# Altium schematic sheet Main.SchDoc
size A3; SheetNumber: 2; SheetTotal: 22
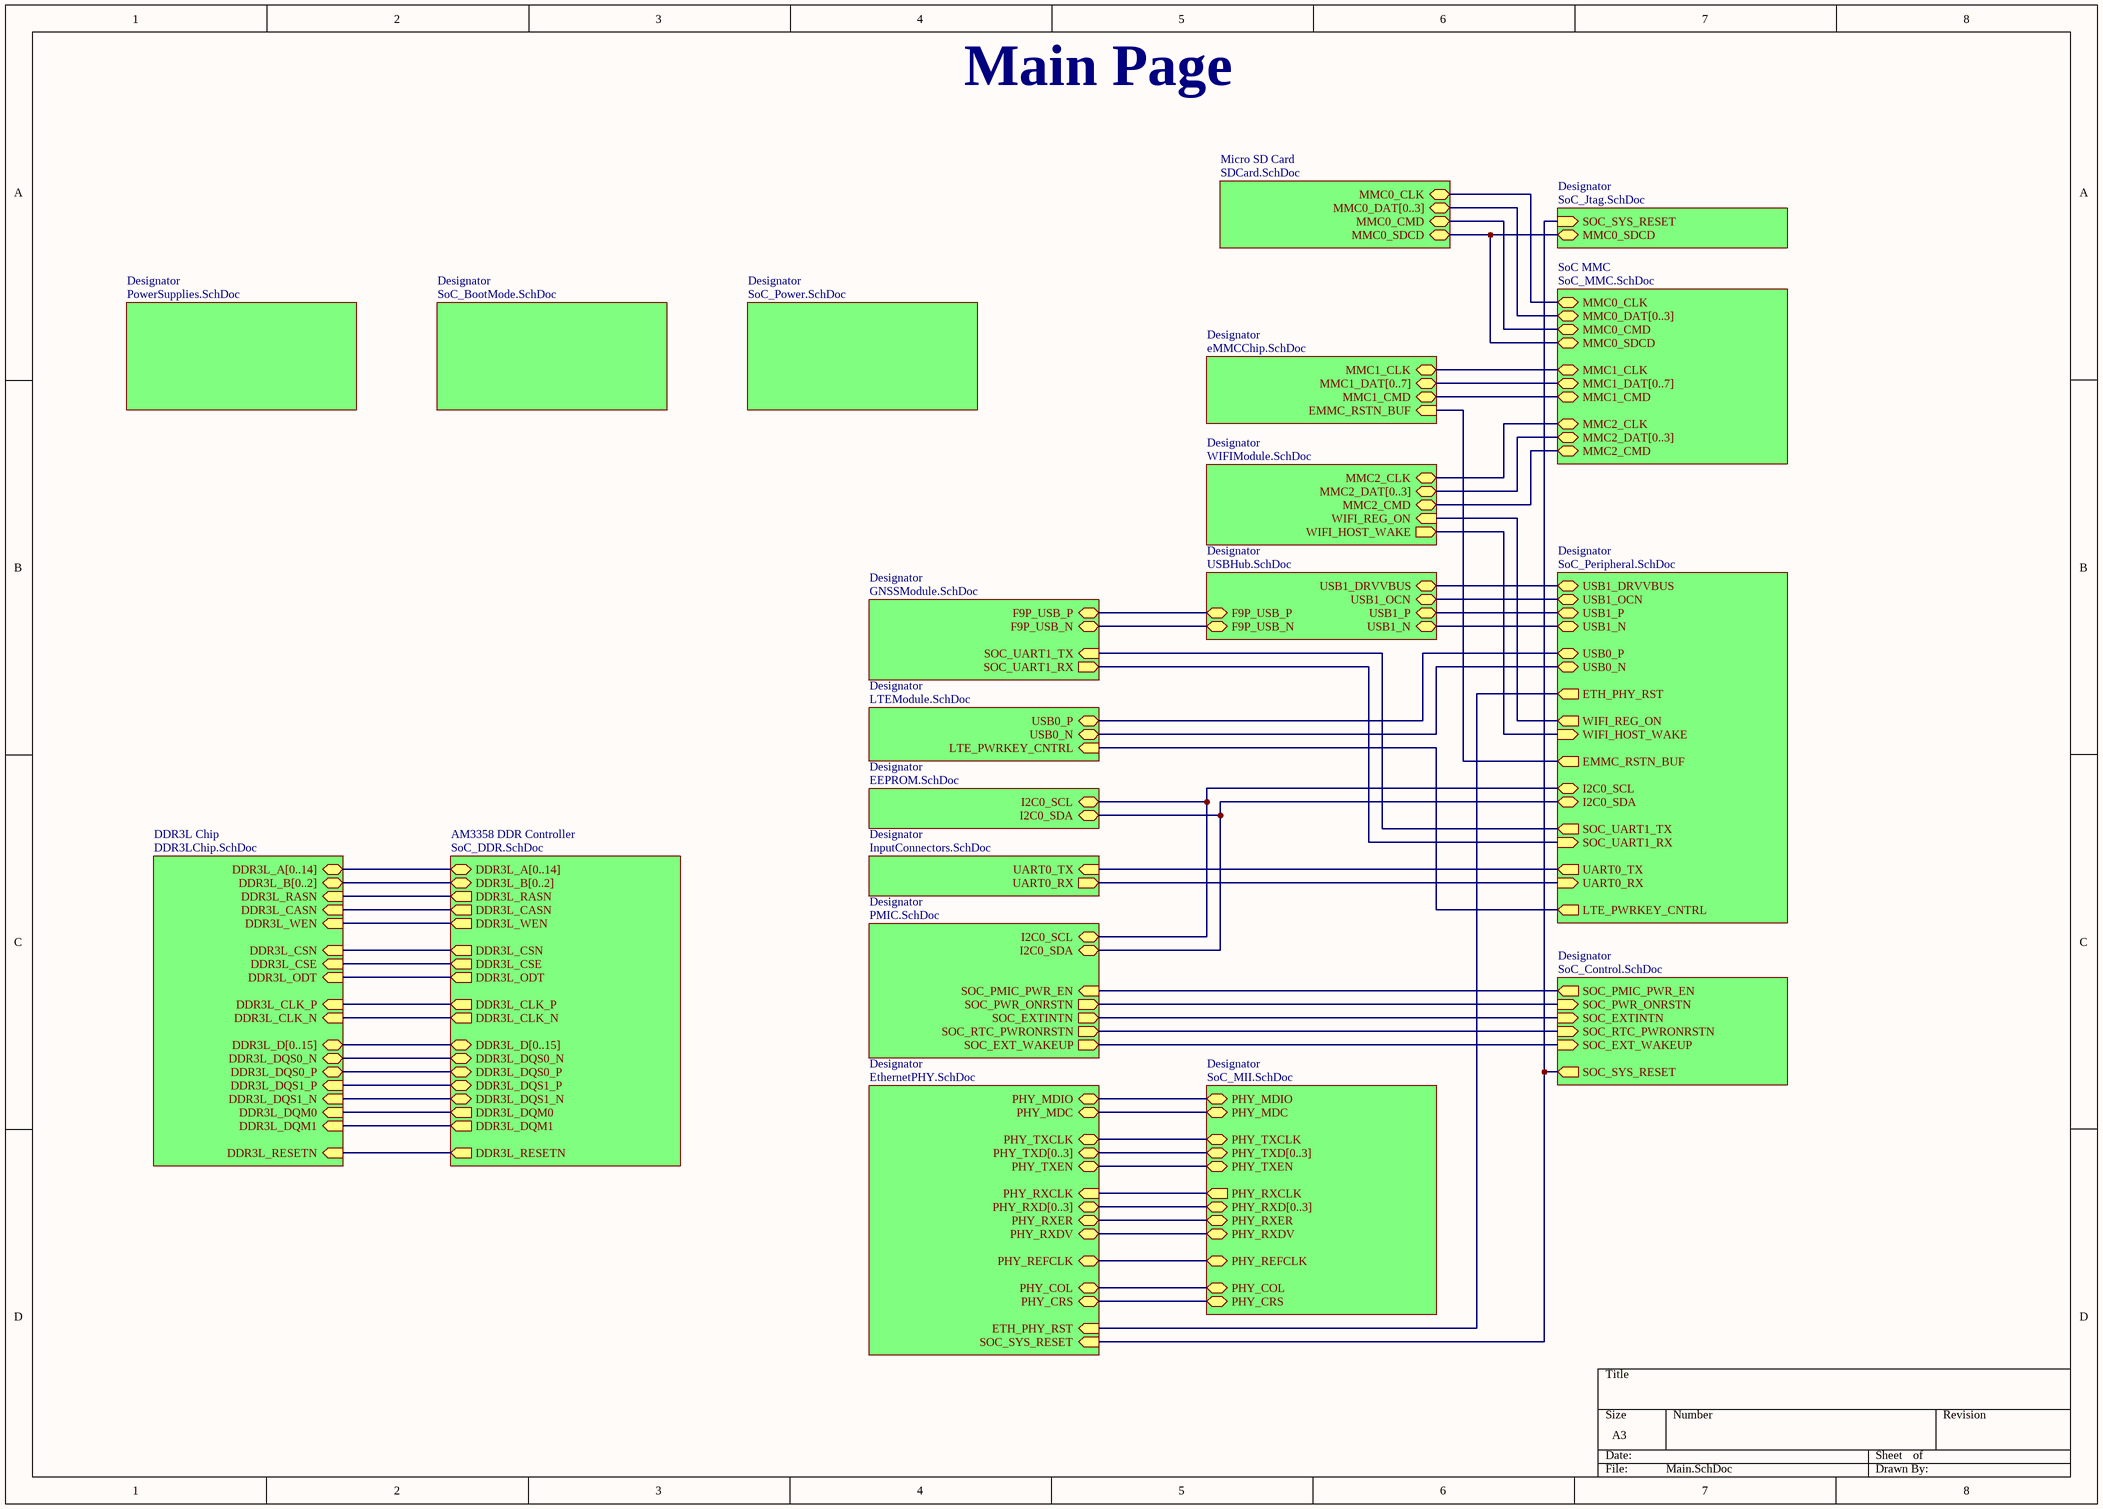
[diagram p0: Main.SchDoc]

## Sub-sheets
AM3358 DDR Controller = SoC_DDR.SchDoc: DDR3L_RASN (out), DDR3L_CASN (out), DDR3L_WEN (out), DDR3L_CSN (out), DDR3L_CSE (out), DDR3L_DQM0 (out), DDR3L_DQM1 (out), DDR3L_DQS0_N (bidir), DDR3L_DQS0_P (bidir), DDR3L_DQS1_N (bidir), DDR3L_RESETN (out), DDR3L_ODT (out), DDR3L_DQS1_P (bidir), DDR3L_A[0..14] (bidir), DDR3L_B[0..2] (bidir), DDR3L_D[0..15] (bidir), DDR3L_CLK_P (out), DDR3L_CLK_N (out)
DDR3L Chip = DDR3LChip.SchDoc: DDR3L_RASN (in), DDR3L_CASN (in), DDR3L_WEN (in), DDR3L_CSN (in), DDR3L_CSE (in), DDR3L_ODT (in), DDR3L_CLK_P (in), DDR3L_CLK_N (in), DDR3L_RESETN (in), DDR3L_DQM0 (in), DDR3L_DQM1 (in), DDR3L_DQS0_N (bidir), DDR3L_DQS0_P (bidir), DDR3L_DQS1_P (in), DDR3L_DQS1_N (in), DDR3L_A[0..14] (bidir), DDR3L_B[0..2] (bidir), DDR3L_D[0..15] (bidir)
Designator = InputConnectors.SchDoc: UART0_TX (in), UART0_RX (out)
Designator = PMIC.SchDoc: I2C0_SCL (bidir), I2C0_SDA (bidir), SOC_PMIC_PWR_EN (in), SOC_PWR_ONRSTN (out), SOC_EXTINTN (out), SOC_RTC_PWRONRSTN (out), SOC_EXT_WAKEUP (out)
Designator = PowerSupplies.SchDoc: no entries
Designator = SoC_BootMode.SchDoc: no entries
Designator = SoC_Power.SchDoc: no entries
Designator = SoC_Control.SchDoc: SOC_PMIC_PWR_EN (out), SOC_PWR_ONRSTN (in), SOC_RTC_PWRONRSTN (in), SOC_EXTINTN (in), SOC_EXT_WAKEUP (in), SOC_SYS_RESET (out)
Designator = eMMCChip.SchDoc: MMC1_CMD (bidir), MMC1_CLK (bidir), MMC1_DAT[0..7] (bidir), EMMC_RSTN_BUF (in)
Designator = SoC_Peripheral.SchDoc: USB1_OCN (bidir), USB1_DRVVBUS (bidir), I2C0_SCL (bidir), I2C0_SDA (bidir), SOC_UART1_TX (out), SOC_UART1_RX (in), UART0_TX (out), UART0_RX (in), USB0_P (bidir), USB0_N (bidir), WIFI_REG_ON (out), WIFI_HOST_WAKE (in), ETH_PHY_RST (out), USB1_P (bidir), USB1_N (bidir), EMMC_RSTN_BUF (out), LTE_PWRKEY_CNTRL (out)
Designator = USBHub.SchDoc: USB1_DRVVBUS (bidir), USB1_OCN (bidir), F9P_USB_P (bidir), F9P_USB_N (bidir), USB1_N (bidir), USB1_P (bidir)
Designator = GNSSModule.SchDoc: F9P_USB_P (bidir), F9P_USB_N (bidir), SOC_UART1_RX (out), SOC_UART1_TX (in)
Designator = LTEModule.SchDoc: LTE_PWRKEY_CNTRL (in), USB0_N (bidir), USB0_P (bidir)
Designator = WIFIModule.SchDoc: MMC2_CMD (bidir), MMC2_CLK (bidir), MMC2_DAT[0..3] (bidir), WIFI_HOST_WAKE (out), WIFI_REG_ON (in)
Designator = EEPROM.SchDoc: I2C0_SCL (bidir), I2C0_SDA (bidir)
Designator = EthernetPHY.SchDoc: SOC_SYS_RESET (in), ETH_PHY_RST (in), PHY_TXCLK (bidir), PHY_TXEN (bidir), PHY_RXDV (bidir), PHY_RXER (bidir), PHY_COL (bidir), PHY_CRS (bidir), PHY_RXD[0..3] (bidir), PHY_RXCLK (in), PHY_REFCLK (bidir), PHY_TXD[0..3] (bidir), PHY_MDIO (bidir), PHY_MDC (bidir)
Designator = SoC_MII.SchDoc: PHY_TXCLK (bidir), PHY_TXEN (bidir), PHY_REFCLK (bidir), PHY_RXD[0..3] (bidir), PHY_TXD[0..3] (bidir), PHY_RXDV (bidir), PHY_RXER (bidir), PHY_CRS (bidir), PHY_COL (bidir), PHY_RXCLK (out), PHY_MDIO (bidir), PHY_MDC (bidir)
Designator = SoC_Jtag.SchDoc: SOC_SYS_RESET (in), MMC0_SDCD (bidir)
Micro SD Card = SDCard.SchDoc: MMC0_DAT[0..3] (bidir), MMC0_CLK (bidir), MMC0_CMD (bidir), MMC0_SDCD (bidir)
SoC MMC = SoC_MMC.SchDoc: MMC0_CLK (bidir), MMC0_CMD (bidir), MMC0_SDCD (bidir), MMC0_DAT[0..3] (bidir), MMC1_DAT[0..7] (bidir), MMC1_CLK (bidir), MMC1_CMD (bidir), MMC2_DAT[0..3] (bidir), MMC2_CMD (bidir), MMC2_CLK (bidir)

## Nets
(unnamed): sheet DDR3L Chip/DDR3L_RASN, sheet AM3358 DDR Controller/DDR3L_RASN
(unnamed): sheet DDR3L Chip/DDR3L_CASN, sheet AM3358 DDR Controller/DDR3L_CASN
(unnamed): sheet DDR3L Chip/DDR3L_WEN, sheet AM3358 DDR Controller/DDR3L_WEN
(unnamed): sheet DDR3L Chip/DDR3L_CSN, sheet AM3358 DDR Controller/DDR3L_CSN
(unnamed): sheet DDR3L Chip/DDR3L_CSE, sheet AM3358 DDR Controller/DDR3L_CSE
(unnamed): sheet DDR3L Chip/DDR3L_ODT, sheet AM3358 DDR Controller/DDR3L_ODT
(unnamed): sheet DDR3L Chip/DDR3L_CLK_P, sheet AM3358 DDR Controller/DDR3L_CLK_P
(unnamed): sheet DDR3L Chip/DDR3L_CLK_N, sheet AM3358 DDR Controller/DDR3L_CLK_N
(unnamed): sheet DDR3L Chip/DDR3L_RESETN, sheet AM3358 DDR Controller/DDR3L_RESETN
(unnamed): sheet DDR3L Chip/DDR3L_DQM0, sheet AM3358 DDR Controller/DDR3L_DQM0
(unnamed): sheet DDR3L Chip/DDR3L_DQM1, sheet AM3358 DDR Controller/DDR3L_DQM1
(unnamed): sheet DDR3L Chip/DDR3L_DQS0_N, sheet AM3358 DDR Controller/DDR3L_DQS0_N
(unnamed): sheet DDR3L Chip/DDR3L_DQS0_P, sheet AM3358 DDR Controller/DDR3L_DQS0_P
(unnamed): sheet DDR3L Chip/DDR3L_DQS1_P, sheet AM3358 DDR Controller/DDR3L_DQS1_P
(unnamed): sheet DDR3L Chip/DDR3L_DQS1_N, sheet AM3358 DDR Controller/DDR3L_DQS1_N
(unnamed): sheet Designator/UART0_TX, sheet Designator/UART0_TX
(unnamed): sheet Designator/UART0_RX, sheet Designator/UART0_RX
(unnamed): sheet Designator/I2C0_SCL, sheet Designator/I2C0_SCL, sheet Designator/I2C0_SCL
(unnamed): sheet Designator/I2C0_SDA, sheet Designator/I2C0_SDA, sheet Designator/I2C0_SDA
(unnamed): sheet Designator/SOC_PMIC_PWR_EN, sheet Designator/SOC_PMIC_PWR_EN
(unnamed): sheet Designator/SOC_PWR_ONRSTN, sheet Designator/SOC_PWR_ONRSTN
(unnamed): sheet Designator/SOC_EXTINTN, sheet Designator/SOC_EXTINTN
(unnamed): sheet Designator/SOC_RTC_PWRONRSTN, sheet Designator/SOC_RTC_PWRONRSTN
(unnamed): sheet Designator/SOC_EXT_WAKEUP, sheet Designator/SOC_EXT_WAKEUP
(unnamed): sheet Designator/SOC_SYS_RESET, sheet Designator/SOC_SYS_RESET, sheet Designator/SOC_SYS_RESET
(unnamed): sheet Designator/MMC1_CMD, sheet SoC MMC/MMC1_CMD
(unnamed): sheet Designator/MMC1_CLK, sheet SoC MMC/MMC1_CLK
(unnamed): sheet Designator/EMMC_RSTN_BUF, sheet Designator/EMMC_RSTN_BUF
(unnamed): sheet SoC MMC/MMC0_CLK, sheet Micro SD Card/MMC0_CLK
(unnamed): sheet SoC MMC/MMC0_CMD, sheet Micro SD Card/MMC0_CMD
(unnamed): sheet SoC MMC/MMC0_SDCD, sheet Designator/MMC0_SDCD, sheet Micro SD Card/MMC0_SDCD
(unnamed): sheet SoC MMC/MMC2_CMD, sheet Designator/MMC2_CMD
(unnamed): sheet SoC MMC/MMC2_CLK, sheet Designator/MMC2_CLK
(unnamed): sheet Designator/USB1_OCN, sheet Designator/USB1_OCN
(unnamed): sheet Designator/USB1_DRVVBUS, sheet Designator/USB1_DRVVBUS
(unnamed): sheet Designator/SOC_UART1_TX, sheet Designator/SOC_UART1_TX
(unnamed): sheet Designator/SOC_UART1_RX, sheet Designator/SOC_UART1_RX
(unnamed): sheet Designator/USB0_P, sheet Designator/USB0_P
(unnamed): sheet Designator/USB0_N, sheet Designator/USB0_N
(unnamed): sheet Designator/WIFI_REG_ON, sheet Designator/WIFI_REG_ON
(unnamed): sheet Designator/WIFI_HOST_WAKE, sheet Designator/WIFI_HOST_WAKE
(unnamed): sheet Designator/ETH_PHY_RST, sheet Designator/ETH_PHY_RST
(unnamed): sheet Designator/USB1_P, sheet Designator/USB1_P
(unnamed): sheet Designator/USB1_N, sheet Designator/USB1_N
(unnamed): sheet Designator/LTE_PWRKEY_CNTRL, sheet Designator/LTE_PWRKEY_CNTRL
(unnamed): sheet Designator/F9P_USB_P, sheet Designator/F9P_USB_P
(unnamed): sheet Designator/F9P_USB_N, sheet Designator/F9P_USB_N
(unnamed): sheet Designator/PHY_TXCLK, sheet Designator/PHY_TXCLK
(unnamed): sheet Designator/PHY_TXEN, sheet Designator/PHY_TXEN
(unnamed): sheet Designator/PHY_RXDV, sheet Designator/PHY_RXDV
(unnamed): sheet Designator/PHY_RXER, sheet Designator/PHY_RXER
(unnamed): sheet Designator/PHY_COL, sheet Designator/PHY_COL
(unnamed): sheet Designator/PHY_CRS, sheet Designator/PHY_CRS
(unnamed): sheet Designator/PHY_RXCLK, sheet Designator/PHY_RXCLK
(unnamed): sheet Designator/PHY_REFCLK, sheet Designator/PHY_REFCLK
(unnamed): sheet Designator/PHY_MDIO, sheet Designator/PHY_MDIO
(unnamed): sheet Designator/PHY_MDC, sheet Designator/PHY_MDC

## Buses and harness runs
bus sheet AM3358 DDR Controller/DDR3L_A[0..14] = sheet DDR3L Chip/DDR3L_A[0..14]
bus sheet AM3358 DDR Controller/DDR3L_B[0..2] = sheet DDR3L Chip/DDR3L_B[0..2]
bus sheet AM3358 DDR Controller/DDR3L_D[0..15] = sheet DDR3L Chip/DDR3L_D[0..15]
bus sheet Designator/MMC1_DAT[0..7] = sheet SoC MMC/MMC1_DAT[0..7]
bus sheet Designator/MMC2_DAT[0..3] = sheet SoC MMC/MMC2_DAT[0..3]
bus sheet Micro SD Card/MMC0_DAT[0..3] = sheet SoC MMC/MMC0_DAT[0..3]

## Notes on the sheet
- Main Page